# Altium schematic sheet ENCODER.SchDoc: Encoder
size 420 x 297 mm; Author: P. Zdunek; CompanyName: WUT ISE; DrawnBy: P. Zdunek; Organization: WUT ISE; Address1: PW ISE; Address2: Nowowiejska 15/19 00-665 Warsaw; Address3: p.zdunek90@gmail.com; DocumentNumber: 10; Revision: 2; SheetNumber: 10; SheetTotal: 10; ModifiedBy: -; CheckedDate: -; DivGrp: WUT ISE; Designer: P. Zdunek; ModifiedDate: -; ProjectName: Sensor Box
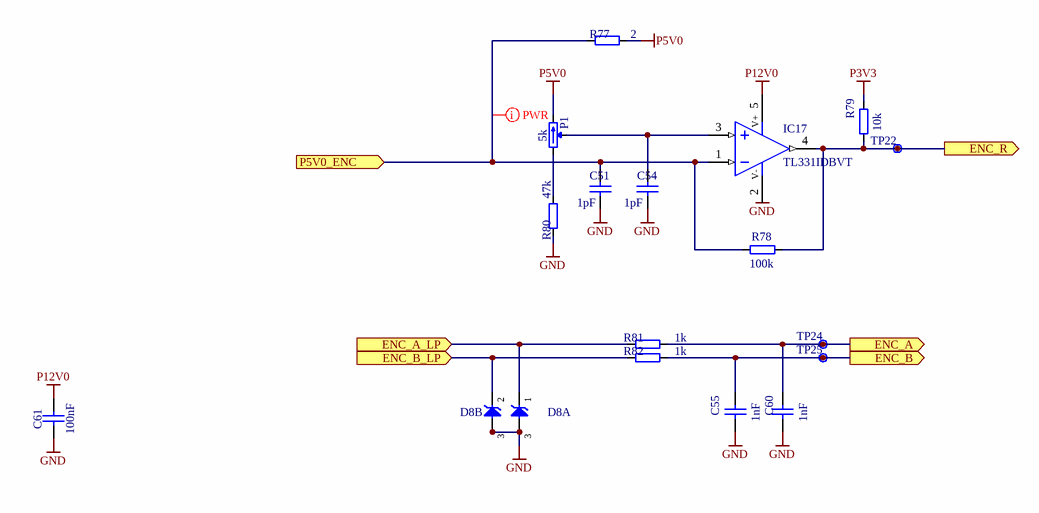
[diagram p0: ENCODER.SchDoc]

## Parts
C51  1pF  [CAPC1005X55N]
C54  1pF  [CAPC1005X55N]
C55  1nF  [CAPC1005X55N]
C60  1nF  [CAPC1005X55N]
C61  100nF  [CAPC1005X55N]
D8  ESD5V3U2U-03F  [SOTFL40P120X59-3N]  (value not drawn)  (parts A,B of 2)
IC17  TL331IDBVT  [SOT95P280X145-5N]
P1  5k  [TRIM_BOURNS_3314G-1]
R77  2  [RESC3216X65N]
R78  100k  [RESC1608X55N]
R79  10k  [RESC1005X40N]
R80  47k  [RESC1608X55N]
R81  1k  [RESC1005X40N]
R82  1k  [RESC1005X40N]
TP22  Plated Hole  [c130h60]  (value not drawn)  (no BOM)
TP24  Plated Hole  [c130h60]  (value not drawn)  (no BOM)
TP25  Plated Hole  [c130h60]  (value not drawn)  (no BOM)

## Ports
ENC_A (out), ENC_A_LP (in), ENC_B (out), ENC_B_LP (in), ENC_R (out), P5V0_ENC (in)

## Nets
GND: C51.1 C54.1 C55.1 C60.1 C61.1 D8.3(COMA) R80.1
P3V3: R79.2
P5V0: P1.3(CW) R77.1
P12V0: C61.2 IC17.5(VS)
ENC_A: C60.2 R81.1 TP24.1 ; port ENC_A
ENC_A_LP: D8.1(C) R81.2 ; port ENC_A_LP
ENC_B: C55.2 R82.1 TP25.1 ; port ENC_B
ENC_B_LP: D8.2(C) R82.2 ; port ENC_B_LP
ENC_R: IC17.4(OUT) R78.1 R79.1 TP22.1 ; port ENC_R
P5V0_ENC: C51.2 IC17.1(IN-) R77.2 R78.2 ; port P5V0_ENC
NetC54_2: C54.2 IC17.3(IN+) P1.2(W)
NetP1_1: P1.1(CCW) R80.2

Not connected (* = marked no-connect by the designer): IC17 2(GND)

## Layout directives
net class PWR: P5V0_ENC

## Notes on the sheet
- Labels drawn without touching a wire or pin: GND
- Project/Equipment
- Document
- Designer
- Drawn by
- Check.by
- Copyright WUT ISE 2020.
  This documentation describes Open Hardware and is licensed under the CERN OHL v.1.2. You may redistribute and modify this documentation under the terms of the CERN OHL v.1.2. (http://ohwr.org/CERNOHL). This documentation is distributed WITHOUT ANY EXPRESS OR IMPLIED WARRANTY, INCLUDING OF MERCHANTABILITY, SATISFACTORY QUALITY AND FITNESS FOR A PARTICULAR PURPOSE. Please see the CERN OHL v.1.2 for applicable conditions.
- Contact
- File
- Last Mod.
- Print Date
- Sheet
- Size
- A3
- of
- Rev
- (in symbol TL331IDBVT) V+; V-

## Library data of the parts
C51 C54 = CC0402_1PF_50V_0.25PF_C0G: Non-polarised capacitor; Part Description: SMD Multilayer Chip Ceramic Capacitor; Manufacturer: GENERIC; Manufacturer1 Part Number: C0402C109C5GACTU; Voltage: 50V; TC: C0G/NP0; Tolerance: ±0.25pF; Part Number: CC0402_1PF_50V_0.25PF_C0G; Component Kind: Standard; Component Type: Standard; Pin Count: 2; Value: 1pF; Status: Preferred; Manufacturer Part Number: CC0402_1PF_50V_0.25PF_C0G; Case: 0402; Mounted: Yes; Socket: No; SMD: Yes; Sense: No; Manufacturer1 Example: KEMET; Manufacturer1 ComponentHeight: 0.55mm; HelpURL: \\cern.ch\dfs\Applications\Altium\Datasheets\CC0402_C0G_KEMET_(Commercial Grade).pdf; Author: CERN DEM JLC; CreateDate: 03/12/2007; LatestRevisionDate: 22/04/2015
C55 C60 = CC0402_1NF_50V_10%_X7R: Non-polarised capacitor; Part Description: SMD Multilayer Chip Ceramic Capacitor; Manufacturer: GENERIC; Manufacturer1 Part Number: 223858715623; Voltage: 50V; TC: X7R; Tolerance: ±10%; Part Number: CC0402_1NF_50V_10%_X7R; Component Kind: Standard; Component Type: Standard; Pin Count: 2; Value: 1nF; Status: Not Recommended; Manufacturer Part Number: CC0402_1NF_50V_10%_X7R; Case: 0402; Mounted: Yes; Socket: No; SMD: Yes; Sense: No; Manufacturer1 Example: PHYCOMP; Manufacturer1 ComponentHeight: 0.55mm; HelpURL: \\cern.ch\dfs\Applications\Altium\Datasheets\CC0402_X7R_PHYCOMP.pdf; Author: CERN DEM JLC; CreateDate: 03/12/2007; LatestRevisionDate: 03/12/2007
C61 = CC0402_100NF_16V_10%_X5R: Non-polarised capacitor; Part Description: SMD Multilayer Chip Ceramic Capacitor; Manufacturer: GENERIC; Manufacturer1 Part Number: GRM155R61C104KA88D; Voltage: 16V; TC: X5R; Tolerance: ±10%; Part Number: CC0402_100NF_16V_10%_X5R; Component Kind: Standard; Component Type: Standard; Pin Count: 2; Value: 100nF; Status: None; Manufacturer Part Number: CC0402_100NF_16V_10%_X5R; Case: 0402; Mounted: Yes; Socket: No; SMD: Yes; Sense: No; Manufacturer1 Example: MURATA; Manufacturer1 ComponentHeight: 0.55mm; HelpURL: \\cern.ch\dfs\Applications\Altium\Datasheets\CC0402_X5R_MURATA_GRM.pdf; Author: CERN DEM JLC; CreateDate: 10.12.2013; LatestRevisionDate: 10.12.2013
D8 = ESD5V3U2U-03F: Dual Common Anode TVS; Part Description: 20kV ESD Ultra-Low Capacitance Uni-Directional TVS Diode Array; Manufacturer: INFINEON; Voltage: 5.3V; PressFit: No; Bonding: No; Part Number: ESD5V3U2U-03F; Component Kind: Standard; Component Type: Standard; Device: ESD5V3U2U-03F; PackageDescription: SOTFL, 0.40mm, Pitch; 3 Pin, 0.80mm W X 1.20mm L X 0.59mm H body, IPC Medium Density; Manufacturer Part Number: ESD5V3U2U-03F; Pin Count: 3; Case: SOTFL3; Mounted: Yes; Socket: No; SMD: Yes; Sense: No; ComponentHeight: 0.59mm; HelpURL: \\cern.ch\dfs\Applications\Altium\Datasheets\ESD5V3U2U-03F.pdf; Author: CERN DEM JLC; CreateDate: 13/03/2012; LatestRevisionDate: 13/03/2012
IC17 = TL331IDBVT: Single Voltage Comparator; Part Description: Single Differential Comparator; Manufacturer: TEXAS INSTRUMENTS; PressFit: No; Bonding: No; Part Number: TL331IDBVT; Component Kind: Standard; Component Type: Standard; Device: TL331IDBVT; PackageDescription: SOT, 0.95mm Pitch; 5 Pin, 1.60mm W X 2.90mm L X 1.45mm H body, IPC Medium Density; Manufacturer Part Number: TL331IDBVT; Pin Count: 5; Case: SOT23-5; Mounted: Yes; Socket: No; SMD: Yes; Sense: No; ComponentHeight: 1.45mm; Author: CERN DEM JLC; HelpURL: \\cern.ch\dfs\Applications\Altium\Datasheets\TL331IDBVT.pdf; CreateDate: 06/11/2018; LatestRevisionDate: 06/11/2018
P1 = TRIM_1T_5K_BOURNS_3314G-1-502E: Trimming Potentiometer; Part Description: Single Turn 4mm Square Trimpot® Trimming Potentiometer (Top Adjust); Manufacturer: BOURNS; Power: 0.25W; TC: ±100ppm/°C; Tolerance: ±20%; PressFit: No; Part Number: TRIM_1T_5K_BOURNS_3314G-1-502E; Component Kind: Standard; Component Type: Standard; Pin Count: 3; Value: 5k; Manufacturer Part Number: 3314G-1-502E; Case: 3314G-1; Mounted: Yes; Socket: No; SMD: Yes; Sense: No; ComponentHeight: 2.55mm; HelpURL: \\cern.ch\dfs\Applications\Altium\Datasheets\TRIM_BOURNS_3314G-1.pdf; Author: CERN DEM JLC; CreateDate: 04/03/2014; LatestRevisionDate: 04/03/2014
R77 = R1206_2R_1%_0.25W_200PPM: Resistor - 1%; Part Description: General Purpose Thick Film Chip Resistor; Manufacturer: GENERIC; Manufacturer1 Part Number: 232272462008L or RC1206FR-072RL; Power: 0.25W; TC: ±200ppm/°C; PressFit: No; Part Number: R1206_2R_1%_0.25W_200PPM; Component Kind: Standard; Component Type: Standard; Pin Count: 2; Value: 2; Status: Preferred; Tolerance: ±1%; Manufacturer Part Number: R1206_2R_1%_0.25W_200PPM; Case: 1206; Mounted: Yes; Socket: No; SMD: Yes; Manufacturer1 Example: YAGEO PHYCOMP; Manufacturer1 ComponentHeight: 0.65mm; HelpURL: \\cern.ch\dfs\Applications\Altium\Datasheets\R1206_Phycomp_RC1206.pdf; Author: CERN DEM JLC; CreateDate: 03/12/2007; LatestRevisionDate: 17/10/2012; Sense: No
R78 = R0603_100K_1%_0.1W_100PPM: Resistor - 1%; Part Description: General Purpose Thick Film Chip Resistor; Manufacturer: GENERIC; Manufacturer1 Part Number: NRC06F1003TRF; Power: 0.1W; TC: ±100ppm/°C; PressFit: No; Part Number: R0603_100K_1%_0.1W_100PPM; Component Kind: Standard; Component Type: Standard; Pin Count: 2; Value: 100k; Status: Preferred; Tolerance: ±1%; Manufacturer Part Number: R0603_100K_1%_0.1W_100PPM; Case: 0603; Mounted: Yes; Socket: No; SMD: Yes; Manufacturer1 Example: NIC COMPONENT; Manufacturer1 ComponentHeight: 0.55mm; HelpURL: \\cern.ch\dfs\Applications\Altium\Datasheets\R0603_NIC_NRC.pdf; Author: CERN DEM JLC; CreateDate: 03/12/2007; LatestRevisionDate: 13/03/2008; Sense: No
R79 = R0402_10K_1%_0.0625W_100PPM: Resistor - 1%; Part Description: General Purpose Thick Film Chip Resistor; Manufacturer: GENERIC; Manufacturer1 Part Number: 232270671003L; TC: ±100ppm/°C; PressFit: No; Part Number: R0402_10K_1%_0.0625W_100PPM; Component Kind: Standard; Component Type: Standard; Pin Count: 2; Value: 10k; Status: Not Recommended; Power: 0.0625W; Tolerance: ±1%; Manufacturer Part Number: R0402_10K_1%_0.0625W_100PPM; Case: 0402; Mounted: Yes; Socket: No; SMD: Yes; Manufacturer1 Example: YAGEO PHYCOMP; Manufacturer1 ComponentHeight: 0.4mm; HelpURL: \\cern.ch\dfs\Applications\Altium\Datasheets\R0402_Phycomp_RC0402.pdf; Author: CERN DEM JLC; CreateDate: 03/12/2007; LatestRevisionDate: 17/10/2012; Sense: No
R80 = R0603_47K_1%_0.1W_100PPM: Resistor - 1%; Part Description: General Purpose Thick Film Chip Resistor; Manufacturer: GENERIC; Manufacturer1 Part Number: NRC06F4702TRF; Power: 0.1W; TC: ±100ppm/°C; PressFit: No; Part Number: R0603_47K_1%_0.1W_100PPM; Component Kind: Standard; Component Type: Standard; Pin Count: 2; Value: 47k; Status: Preferred; Tolerance: ±1%; Manufacturer Part Number: R0603_47K_1%_0.1W_100PPM; Case: 0603; Mounted: Yes; Socket: No; SMD: Yes; Manufacturer1 Example: NIC COMPONENT; Manufacturer1 ComponentHeight: 0.55mm; HelpURL: \\cern.ch\dfs\Applications\Altium\Datasheets\R0603_NIC_NRC.pdf; Author: CERN DEM JLC; CreateDate: 03/12/2007; LatestRevisionDate: 13/03/2008; Sense: No
R81 R82 = R0402_1K_1%_0.0625W_100PPM: Resistor - 1%; Part Description: General Purpose Thick Film Chip Resistor; Manufacturer: GENERIC; Manufacturer1 Part Number: 232270671002L; TC: ±100ppm/°C; PressFit: No; Part Number: R0402_1K_1%_0.0625W_100PPM; Component Kind: Standard; Component Type: Standard; Pin Count: 2; Value: 1k; Status: Not Recommended; Power: 0.0625W; Tolerance: ±1%; Manufacturer Part Number: R0402_1K_1%_0.0625W_100PPM; Case: 0402; Mounted: Yes; Socket: No; SMD: Yes; Manufacturer1 Example: YAGEO PHYCOMP; Manufacturer1 ComponentHeight: 0.4mm; HelpURL: \\cern.ch\dfs\Applications\Altium\Datasheets\R0402_Phycomp_RC0402.pdf; Author: CERN DEM JLC; CreateDate: 03/12/2007; LatestRevisionDate: 17/10/2012; Sense: No
TP22 TP24 TP25 = PLATED_HOLE0.6_PAD1.3: Single Terminal Socket; Part Description: Plated Through Hole: Hole Dia.=0.6mm Pad Dia.=1.3mm; Mounted: No; Part Number: PLATED_HOLE0.6_PAD1.3; Component Type: Standard (No BOM); Pin Count: 1; Family: Plated Hole; Socket: No; SMD: No; Sense: No; Status: None; ComponentHeight: 0mm; HelpURL: Undefined; Author: CERN DEM MR; CreateDate: 02/03/2016; LatestRevisionDate: 02/03/2016; PackageDescription: Plated Through Hole: Hole Dia.=0.6mm Pad Dia.=1.3mm